# EAGLE design databank (EAGLE 6.3)
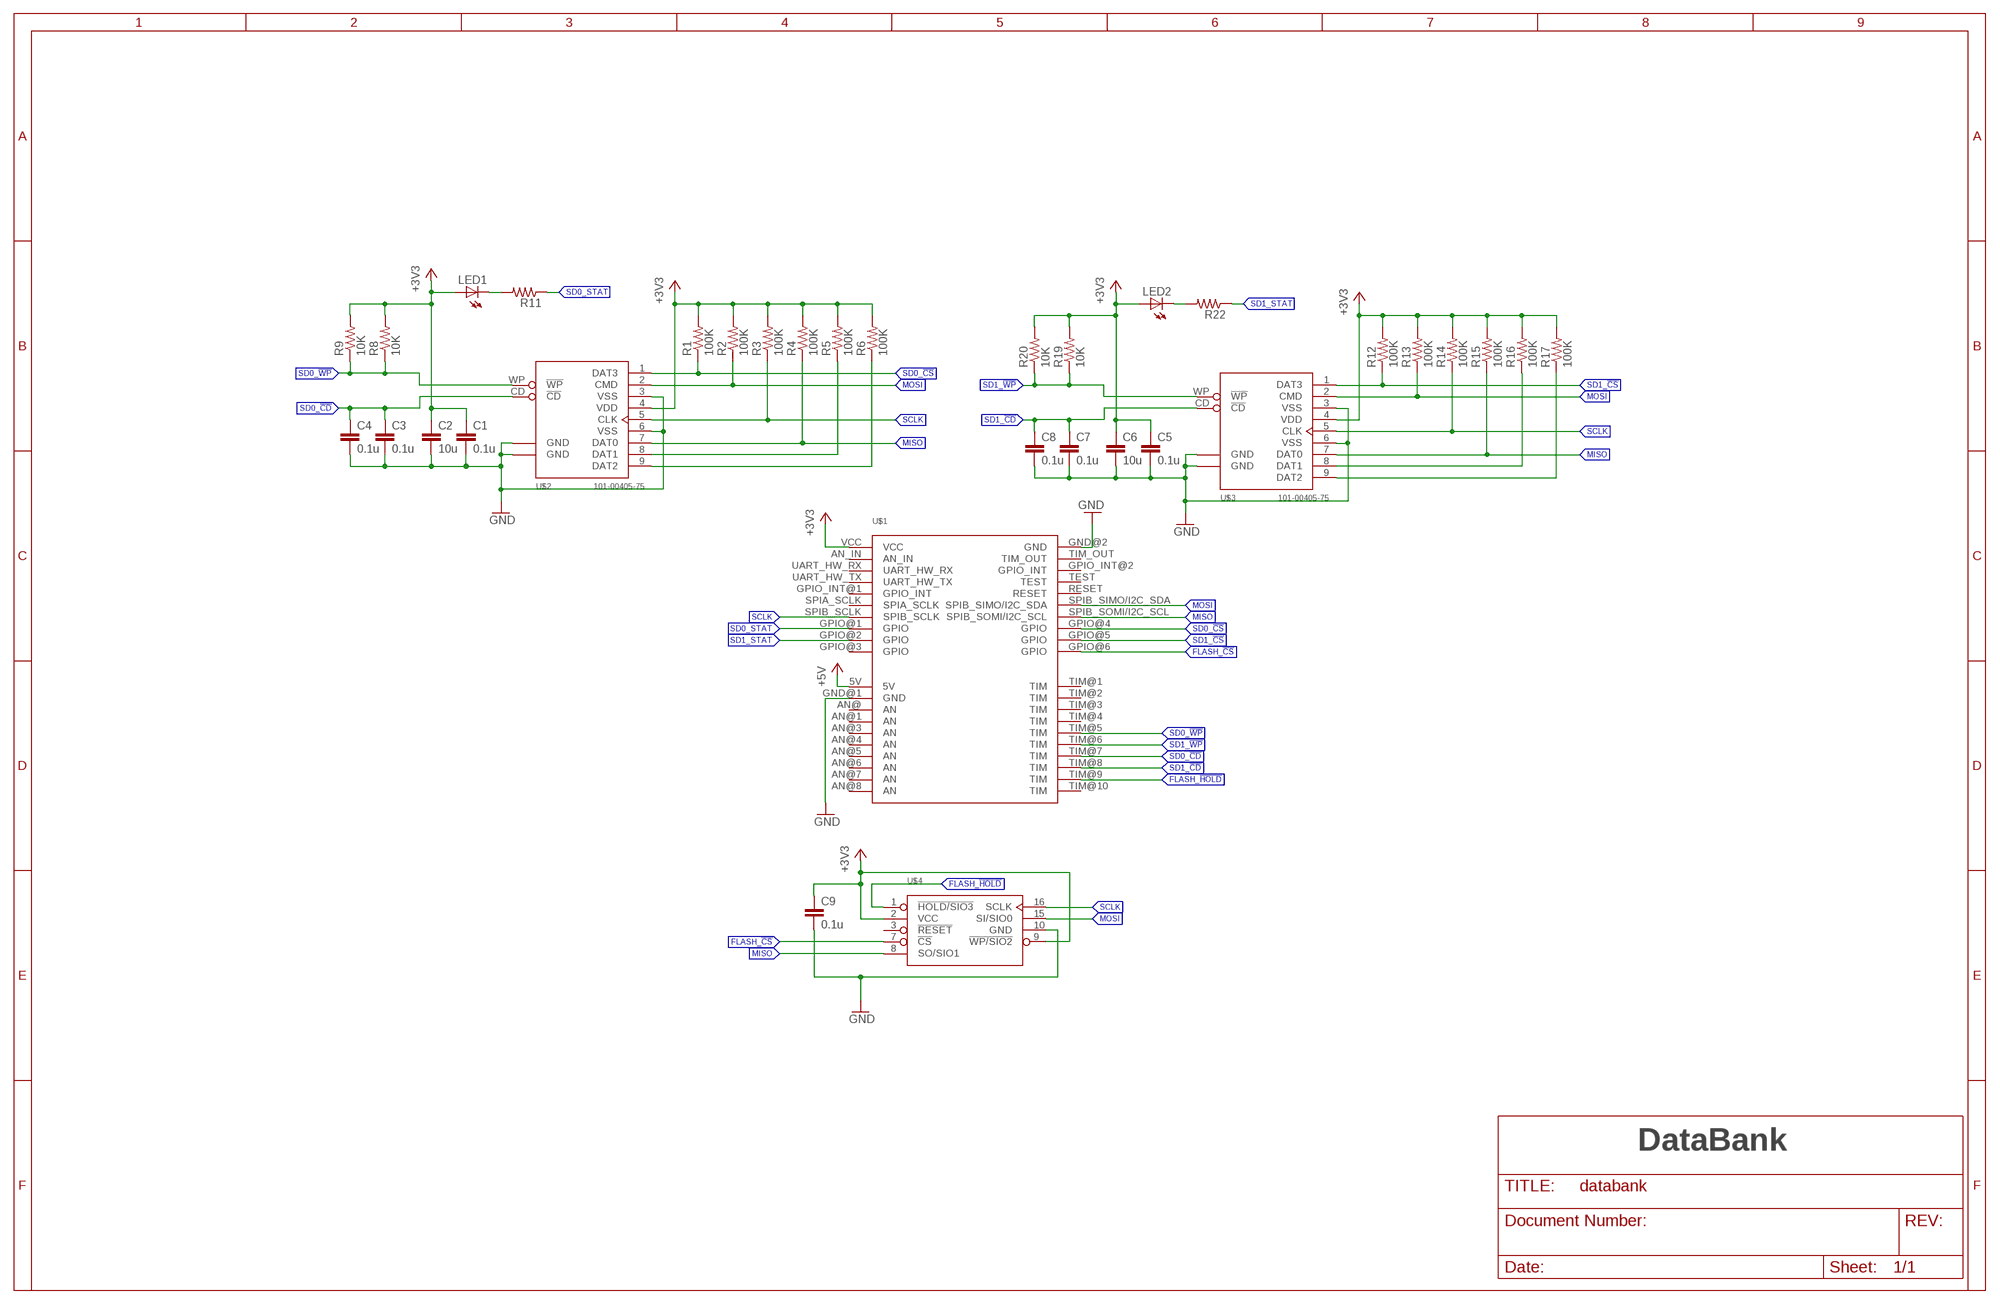
[diagram p0: schematic, sheet 1]

## Parts
C1  0.1u  C-EUC0603  [C0603]
C2  10u  C-EUC0603  [C0603]
C3  0.1u  C-EUC0603  [C0603]
C4  0.1u  C-EUC0603  [C0603]
C5  0.1u  C-EUC0603  [C0603]
C6  10u  C-EUC0603  [C0603]
C7  0.1u  C-EUC0603  [C0603]
C8  0.1u  C-EUC0603  [C0603]
C9  0.1u  C-EUC0603  [C0603]
LED1  LEDCHIP-LED0603  [CHIP-LED0603]
LED2  LEDCHIP-LED0603  [CHIP-LED0603]
R1  100K  R-US_R0603  [R0603]
R2  100K  R-US_R0603  [R0603]
R3  100K  R-US_R0603  [R0603]
R4  100K  R-US_R0603  [R0603]
R5  100K  R-US_R0603  [R0603]
R6  100K  R-US_R0603  [R0603]
R8  10K  R-US_R0603  [R0603]
R9  10K  R-US_R0603  [R0603]
R11  R-US_R0603  [R0603]
R12  100K  R-US_R0603  [R0603]
R13  100K  R-US_R0603  [R0603]
R14  100K  R-US_R0603  [R0603]
R15  100K  R-US_R0603  [R0603]
R16  100K  R-US_R0603  [R0603]
R17  100K  R-US_R0603  [R0603]
R19  10K  R-US_R0603  [R0603]
R20  10K  R-US_R0603  [R0603]
R22  R-US_R0603  [R0603]
U$1  LAUNCHPAD_BOOSTER_PACK  [LAUNCHPAD_BOOSTER_PACK]
U$2  101-00405-75  [101-00405-75]
U$3  101-00405-75  [101-00405-75]
U$4  MX25L25635E  [SO-16LD]

## Nets
+3V3: C1.1 C2.1 C5.1 C6.1 C9.1 LED1.A LED2.A R1.2 R2.2 R3.2 R4.2 R5.2 R6.2 R8.2 R9.2 R12.2 R13.2 R14.2 R15.2 R16.2 R17.2 R19.2 R20.2 U$1.VCC U$2.4(VDD) U$3.4(VDD) U$4.2(VCC) U$4.9(!WP/SIO2)
+5V: U$1.5V
FLASH_!CS: U$1.GPIO@6(GPIO) U$4.7(!CS)
FLASH_!HOLD: U$1.TIM@9(TIM) U$4.1(!HOLD/SIO3)
GND: C1.2 C2.2 C3.2 C4.2 C5.2 C6.2 C7.2 C8.2 C9.2 U$1.GND@1(GND) U$1.GND@2(GND) U$2.3(VSS) U$2.6(VSS) U$2.G1$GND(GND) U$2.G2$GND(GND) U$3.3(VSS) U$3.6(VSS) U$3.G1$GND(GND) U$3.G2$GND(GND) U$4.10(GND)
MISO: R4.1 R15.1 U$1.SPIB_SOMI/I2C_SCL U$2.7(DAT0) U$3.7(DAT0) U$4.8(SO/SIO1)
MOSI: R2.1 R13.1 U$1.SPIB_SIMO/I2C_SDA U$2.2(CMD) U$3.2(CMD) U$4.15(SI/SIO0)
N$1: LED1.C R11.2
N$2: R16.1 U$3.8(DAT1)
N$3: R17.1 U$3.9(DAT2)
N$5: R5.1 U$2.8(DAT1)
N$6: R6.1 U$2.9(DAT2)
N$10: LED2.C R22.2
SCLK: R3.1 R14.1 U$1.SPIB_SCLK U$2.5(CLK) U$3.5(CLK) U$4.16(SCLK)
SD0_!CD: C3.1 C4.1 U$1.TIM@7(TIM) U$2.CD(!CD)
SD0_!CS: R1.1 U$1.GPIO@4(GPIO) U$2.1(DAT3)
SD0_!WP: R8.1 R9.1 U$1.TIM@5(TIM) U$2.WP(!WP)
SD0_STAT: R11.1 U$1.GPIO@1(GPIO)
SD1_!CD: C7.1 C8.1 U$1.TIM@8(TIM) U$3.CD(!CD)
SD1_!CS: R12.1 U$1.GPIO@5(GPIO) U$3.1(DAT3)
SD1_!WP: R19.1 R20.1 U$1.TIM@6(TIM) U$3.WP(!WP)
SD1_STAT: R22.1 U$1.GPIO@2(GPIO)
Unconnected: U$1.AN@1(AN) U$1.AN@3(AN) U$1.AN@4(AN) U$1.AN@5(AN) U$1.AN@6(AN) U$1.AN@7(AN) U$1.AN@8(AN) U$1.AN@(AN) U$1.AN_IN U$1.GPIO@3(GPIO) U$1.GPIO_INT@1(GPIO_INT) U$1.GPIO_INT@2(GPIO_INT) U$1.RESET U$1.SPIA_SCLK U$1.TEST U$1.TIM@1(TIM) U$1.TIM@2(TIM) U$1.TIM@3(TIM) U$1.TIM@4(TIM) U$1.TIM@10(TIM) U$1.TIM_OUT U$1.UART_HW_RX U$1.UART_HW_TX U$4.3(!RESET)

## Notes on the sheet
- DataBank

## Library data of the parts
C1-C9 = rcl:C-EU: CAPACITOR, European symbol
LED1 LED2 = led:LED: LED OSRAM: - CHIPLED LG R971, LG N971, LY N971, LG Q971, LY Q971, LO R971, LY R971 LH N974, LH R974 LS Q976, LO Q976, LY Q976 LO Q996 - Hyper CHIPLED LW Q18S LB Q993, LB Q99A, LB R99A - SideLED LS A670, LO A670, LY A670, LG A670, LP A670 LB A673, LV A673, LT A673, LW A673 LH A674 LY A675 LS A676, LA A676, LO A676, LY A676, LW A676 LS A679, LY A679, LG A679 - Hyper Micro SIDELED® LS Y876, LA Y876, LO Y876, LY Y876 LT Y87S - SmartLED LW L88C, LW L88S LB L89C, LB L89S, LG L890 LS L89K, LO L89K, LY L89K LS L896, LA L896, LO L896, LY L896 - TOPLED LS T670, LO T670, LY T670, LG T670, LP T670 LSG T670, LSP T670, LSY T670, LOP T670, LYG T670 LG T671, LOG T671, LSG T671 LB T673, LV T673, LT T673, LW T673 LH T674 LS T676, LA T676, LO T676, LY T676, LB T676, LH T676, LSB T676, LW T676 LB T67C, LV T67C, LT T67C, LS T67K, LO T67K, LY T67K, LW E67C LS E67B, LA E67B, LO E67B, LY E67B, LB E67C, LV E67C, LT E67C LW T67C LS T679, LY T679, LG T679 LS T770, LO T770, LY T770, LG T770, LP T770 LB T773, LV T773, LT T773, LW T773 LH T774 LS E675, LA E675, LY E675, LS T675 LS T776, LA T776, LO T776, LY T776, LB T776 LHGB T686 LT T68C, LB T68C - Hyper Mini TOPLED® LB M676 - Mini TOPLED Santana® LG M470 LS M47K, LO M47K, LY M47K Source: http://www.osram.convergy.de LUXEON: - LUMILED® LXK2-PW12-R00, LXK2-PW12-S00, LXK2-PW14-U00, LXK2-PW14-V00 LXK2-PM12-R00, LXK2-PM12-S00, LXK2-PM14-U00 LXK2-PE12-Q00, LXK2-PE12-R00, LXK2-PE12-S00, LXK2-PE14-T00, LXK2-PE14-U00 LXK2-PB12-K00, LXK2-PB12-L00, LXK2-PB12-M00, LXK2-PB14-N00, LXK2-PB14-P00, LXK2-PB14-Q00 LXK2-PR12-L00, LXK2-PR12-M00, LXK2-PR14-Q00, LXK2-PR14-R00 LXK2-PD12-Q00, LXK2-PD12-R00, LXK2-PD12-S00 LXK2-PH12-R00, LXK2-PH12-S00 LXK2-PL12-P00, LXK2-PL12-Q00, LXK2-PL12-R00 Source: www.luxeon.com KINGBRIGHT: KA-3528ASYC Source: www.kingbright.com
R1-R6 R8 R9 R11-R17 R19 R20 R22 = rcl:R-US_: RESISTOR, American symbol
U$1 = Boards:LAUNCHPAD_BOOSTER_PACK
U$2 U$3 = launchpad_bp:101-00405-75
U$4 = launchpad_bp:MX25L25635E

## Net classes
0 default: width 0.152 mm, drill 0.381 mm, clearance 0.152 mm
1 pwr: width 0.305 mm, drill 0.381 mm, clearance 0.152 mm

## Board
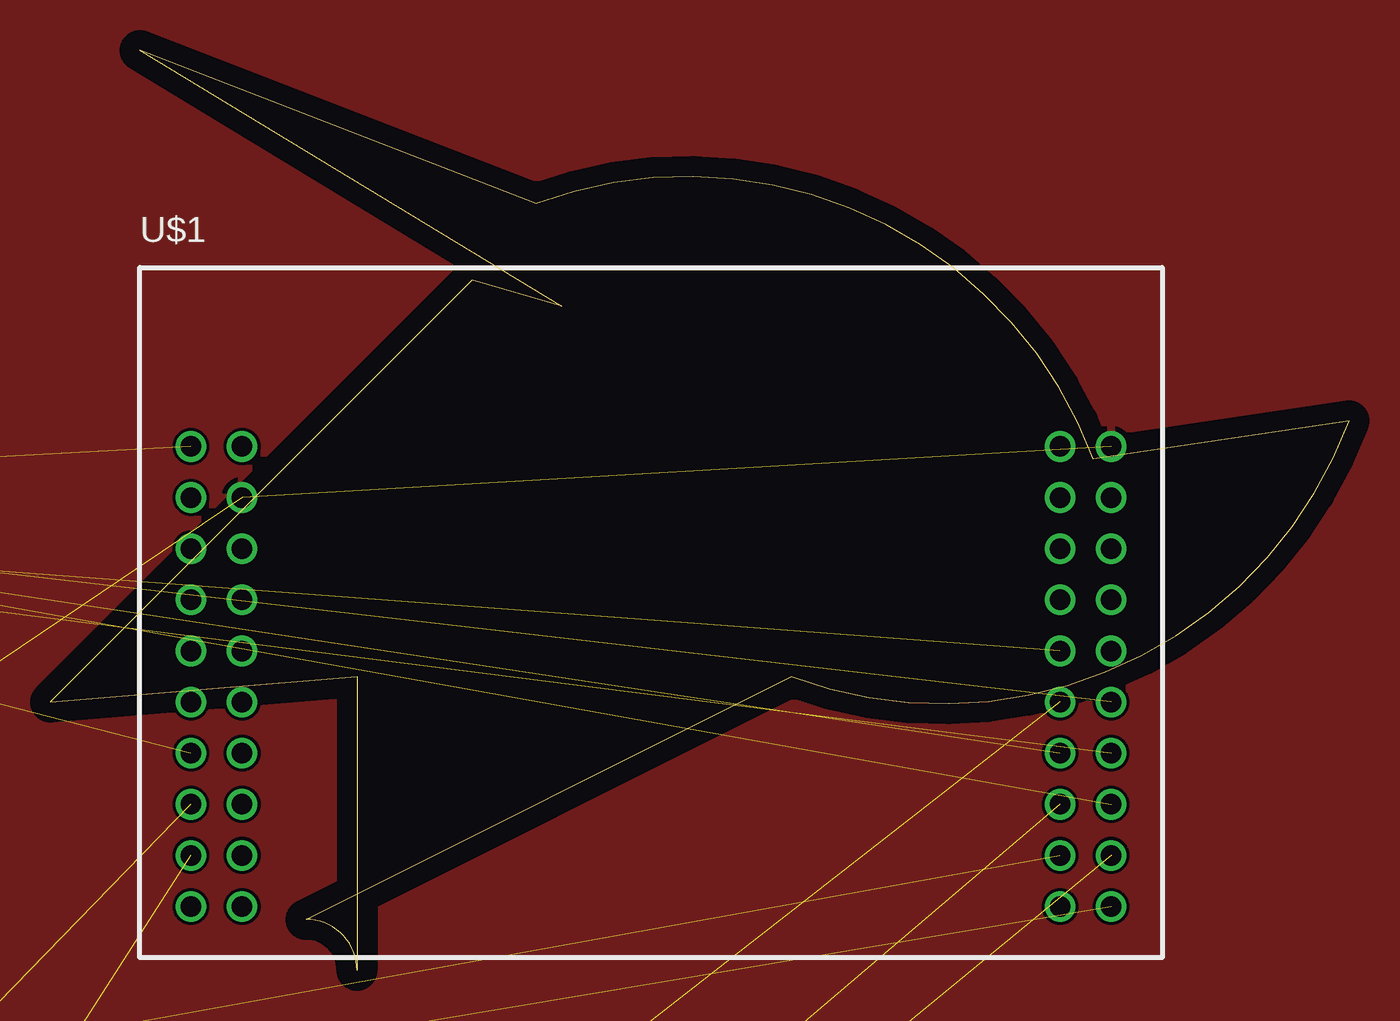
[diagram p1: board, top side]
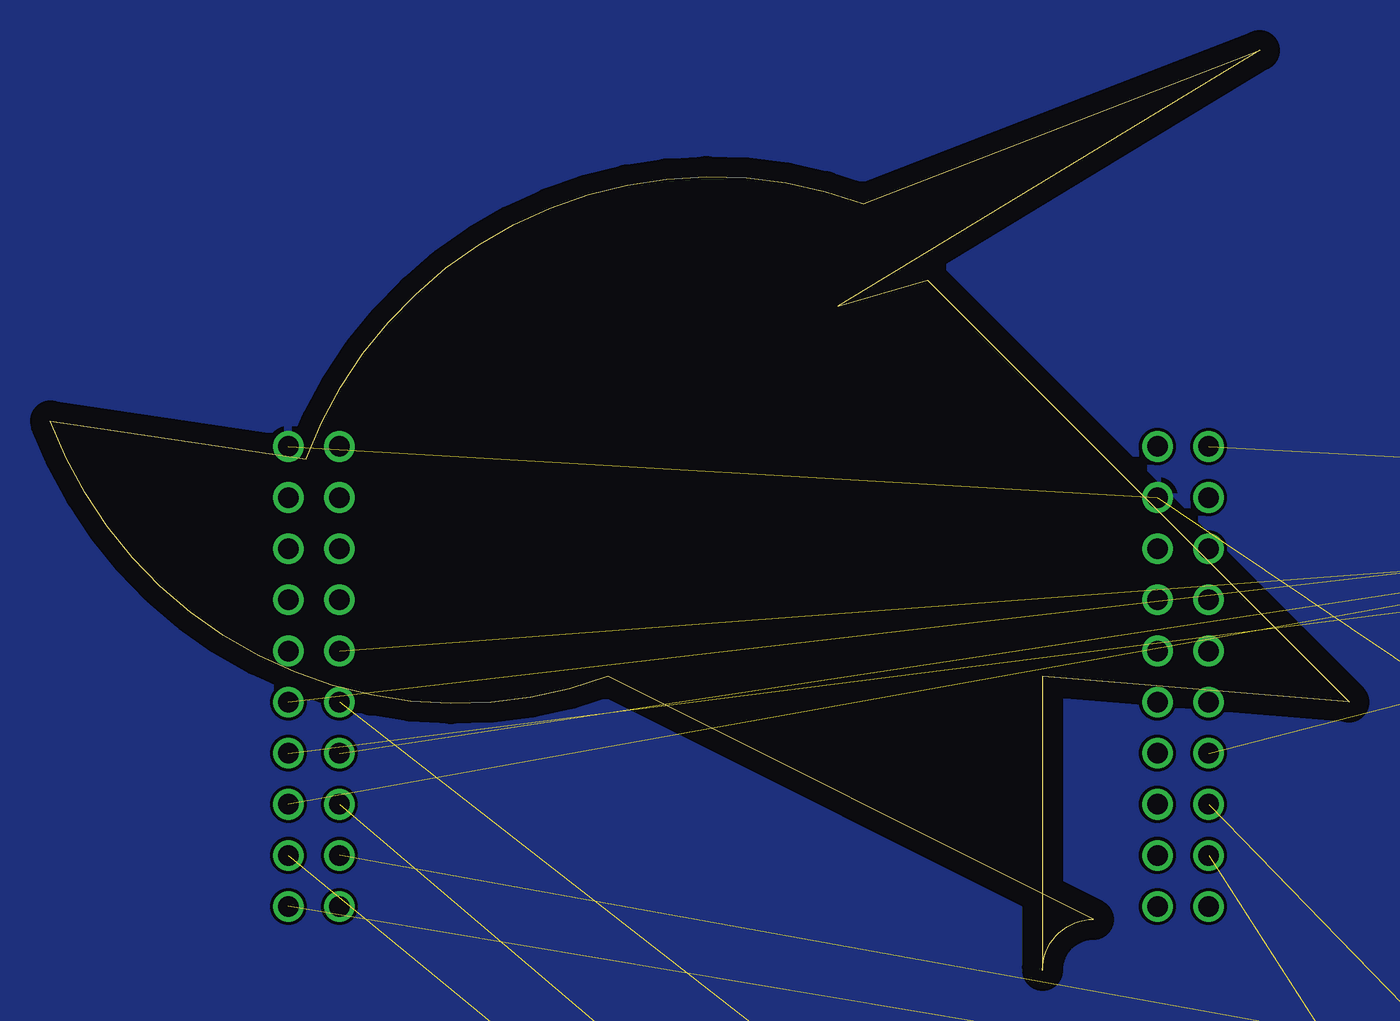
[diagram p2: board, bottom side, seen from below]

Size 64.53 x 45.72 mm. Coordinates in mm from the lower left corner, seen from the top.
Outline: 15.24,14.61 15.24,0 arc90 12.7,2.54 36.83,14.61 arc90 64.53,27.3 51.83,25.4 arc90 24.13,38.1 4.45,45.72 25.4,33.02 20.95,34.29 0,13.33 15.24,14.61
Copper layers (1*16): Top 0.035mm / dielectric 1.5mm / Bottom 0.035mm
Design rules "default *": minimum track width 6mil, minimum drill 15mil, track to track 6mil, track to pad 6mil, pad to pad 6mil, via to via 6mil, smd to smd 6mil, copper to edge 40mil, drill to drill 8mil, minimum pad ring 10mil, minimum via ring 8mil, stop-mask expansion 4mil, vias tented up to drill 20mil, thermal gap 10mil

### Footprints (pad centres in the part's own frame; a part is rotated, then mirrored left to right if it is on the bottom)
C0603 = smd 1.1 x 1: 1 -0.85,0; 2 0.85,0
CHIP-LED0603 = smd 0.8 x 0.8: A 0,-0.75; C 0,0.75
R0603 = smd 1 x 1.1: 1 -0.85,0; 2 0.85,0
LAUNCHPAD_BOOSTER_PACK = drill 1.016: 5V -20.32,8.89; AN@ -20.32,1.27; AN@1 -20.32,3.81; AN@3 -20.32,-1.27; AN@4 -20.32,-3.81; AN@5 -20.32,-6.35; AN@6 -20.32,-8.89; AN@7 -20.32,-11.43; AN@8 -20.32,-13.97; AN_IN -22.86,6.35; GND@1 -20.32,6.35; GND@2 22.86,8.89; GPIO@1 -22.86,-8.89; GPIO@2 -22.86,-11.43; GPIO@3 -22.86,-13.97; GPIO@4 22.86,-8.89; GPIO@5 22.86,-11.43; GPIO@6 22.86,-13.97; GPIO_INT@1 -22.86,-1.27; GPIO_INT@2 22.86,3.81; RESET 22.86,-1.27; SPIA_SCLK -22.86,-3.81; SPIB_SCLK -22.86,-6.35; SPIB_SIMO/I2C_SDA 22.86,-3.81; SPIB_SOMI/I2C_SCL 22.86,-6.35; TEST 22.86,1.27; TIM@1 20.32,8.89; TIM@2 20.32,6.35; TIM@3 20.32,3.81; TIM@4 20.32,1.27; TIM@5 20.32,-1.27; TIM@6 20.32,-3.81; TIM@7 20.32,-6.35; TIM@8 20.32,-8.89; TIM@9 20.32,-11.43; TIM@10 20.32,-13.97; TIM_OUT 22.86,6.35; UART_HW_RX -22.86,3.81; UART_HW_TX -22.86,1.27; VCC -22.86,8.89
101-00405-75 = smd 0.7 x 1.6: 1 -2.5,0; 2 -5,0; 3 -7.5,0; 4 -10,0; 5 -12.5,0; 6 -15,0; 7 -17.425,0; 8 -19.125,0; 9 0,0 | smd 0.95 x 1.6: CD -3.875,0 | smd 2.3 x 3: G1$GND -23.025,-23; G2$GND 5.275,-23 | smd 1.2 x 1.6: WP -21.43,0 | hole 1.2: -21.175,-2.1; 3.425,-2.1
SO-16LD = smd 0.762 x 1.524: 1 -4.445,-4.775; 2 -3.175,-4.775; 3 -1.905,-4.775; 4 -0.635,-4.775; 5 0.635,-4.775; 6 1.905,-4.775; 7 3.175,-4.775; 8 4.445,-4.775; 9 4.445,4.775; 10 3.175,4.775; 11 1.905,4.775; 12 0.635,4.775; 13 -0.635,4.775; 14 -1.905,4.775; 15 -3.175,4.775; 16 -4.445,4.775

### Placement (x,y rotation side)
C1  -83.19,-21.59 0 top  (outside the outline)
C2  -88.9,-55.88 0 top  (outside the outline)
C3  -88.9,-66.04 0 top  (outside the outline)
C4  -88.9,-86.36 0 top  (outside the outline)
C5  -88.9,-132.08 0 top  (outside the outline)
C6  -71.75,-132.08 0 top  (outside the outline)
C7  -83.19,-132.08 0 top  (outside the outline)
C8  -77.47,-132.08 0 top  (outside the outline)
C9  -88.9,-140.97 0 top  (outside the outline)
LED1  -88.26,-24.77 0 top  (outside the outline)
LED2  -52.7,-97.16 0 top  (outside the outline)
R1  -83.19,-25.4 0 top  (outside the outline)
R2  -88.9,-30.48 0 top  (outside the outline)
R3  -88.9,-35.56 0 top  (outside the outline)
R4  -88.9,-40.64 0 top  (outside the outline)
R5  -88.9,-45.72 0 top  (outside the outline)
R6  -88.9,-50.8 0 top  (outside the outline)
R8  -88.9,-71.12 0 top  (outside the outline)
R9  -88.9,-76.2 0 top  (outside the outline)
R11  -88.9,-91.44 0 top  (outside the outline)
R12  -88.9,-127 0 top  (outside the outline)
R13  -82.55,-127 0 top  (outside the outline)
R14  -76.2,-127 0 top  (outside the outline)
R15  -69.85,-127 0 top  (outside the outline)
R16  -63.5,-127 0 top  (outside the outline)
R17  -57.15,-127 0 top  (outside the outline)
R19  -61.59,-132.08 0 top  (outside the outline)
R20  -56.52,-132.08 0 top  (outside the outline)
R22  -83.82,-137.16 0 top  (outside the outline)
U$1  29.84,17.14 0 top
U$2  -29.84,23.49 0 top  (outside the outline)
U$3  -66.04,-93.98 0 top  (outside the outline)
U$4  -77.47,-13.34 0 top  (outside the outline)

### Tracks (layer width: path | path; a pad name or v marks a point on that pad's centre or on a via)
+3V3  (27 unrouted)
FLASH_!CS  (1 unrouted)
FLASH_!HOLD  (1 unrouted)
GND  (19 unrouted)
  pour Bottom: -19.81,49.17 80.47,49.17 80.47,-7.32 -20.42,-7.32 -20.42,48.87
  pour Top: -20.32,50.09 80.16,50.09 80.16,-7.21 -20.83,-7.21 -20.83,50.19
MISO  (5 unrouted)
MOSI  (5 unrouted)
N$1  (1 unrouted)
N$2  (1 unrouted)
N$3  (1 unrouted)
N$5  (1 unrouted)
N$6  (1 unrouted)
N$10  (1 unrouted)
SCLK  (5 unrouted)
SD0_!CD  (3 unrouted)
SD0_!CS  (2 unrouted)
SD0_!WP  (3 unrouted)
SD0_STAT  (1 unrouted)
SD1_!CD  (3 unrouted)
SD1_!CS  (2 unrouted)
SD1_!WP  (3 unrouted)
SD1_STAT  (1 unrouted)

### Text on the board
tPlace: Interacto | hitchhikeree.org
bPlace: Interacto | hitchhikeree.org